# Altium schematic sheet VD Sensors.SchDoc
size A4
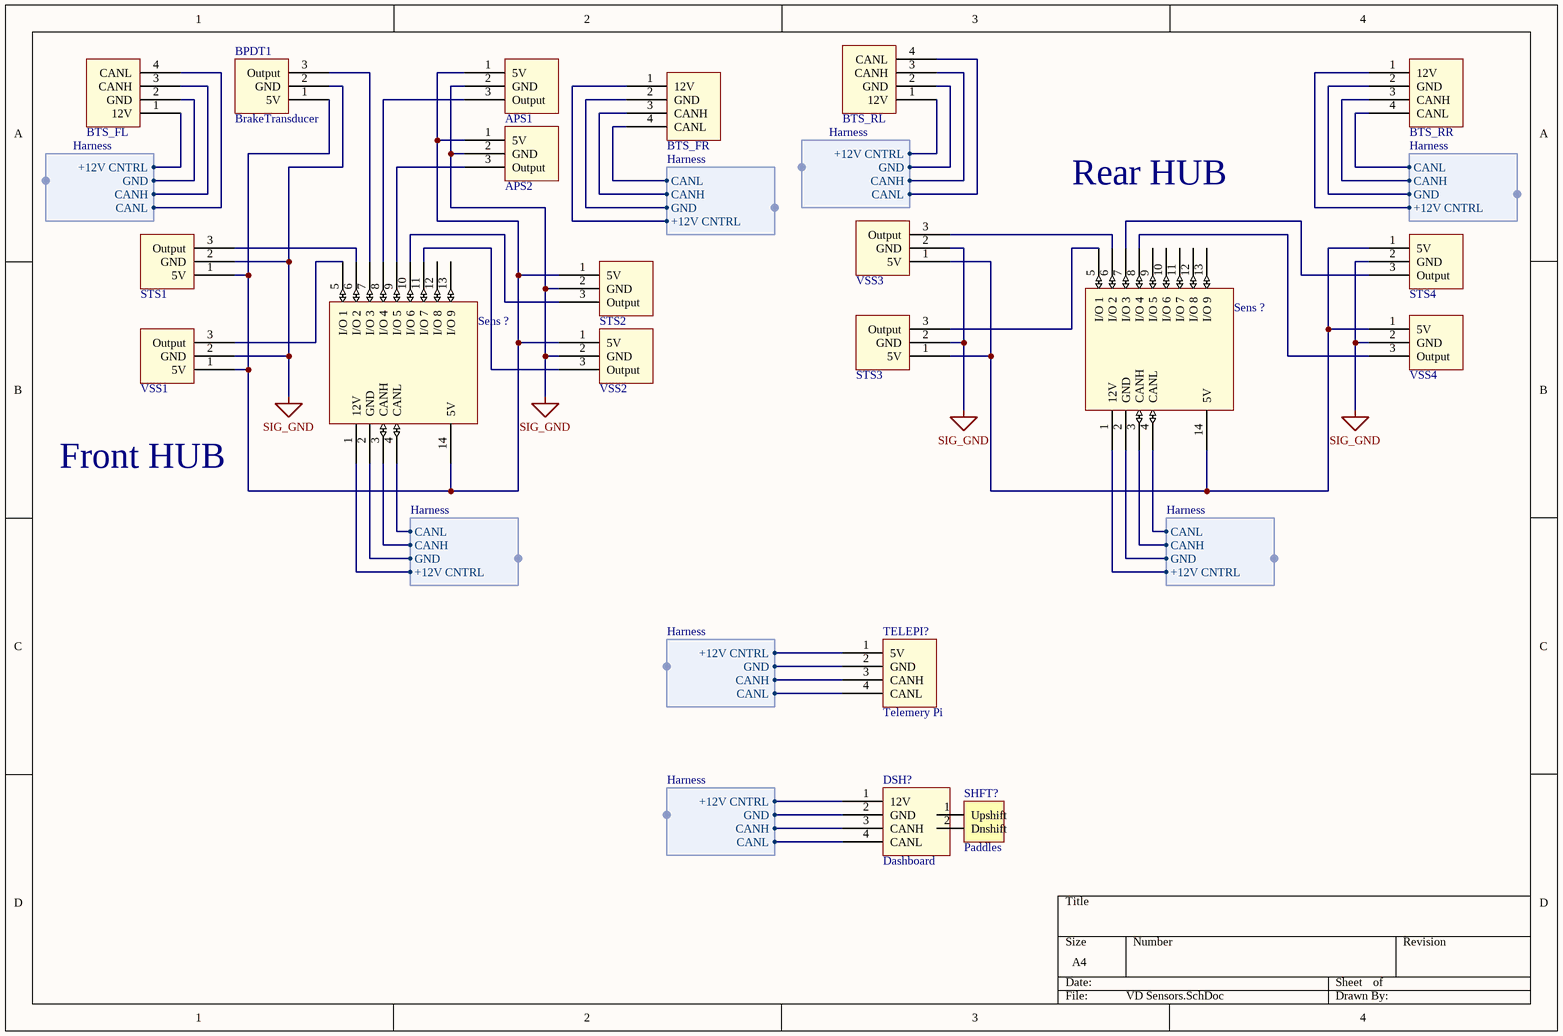
[diagram p0: VD Sensors.SchDoc]

## Parts
(Parts that share a designator on the sheet are numbered #1, #2 ... from top to bottom, then left to right.)
APS1  APS  (value not drawn)
APS2  APS  (value not drawn)
BPDT1  BrakeTransducer
BTS_FL  BTS  (value not drawn)
BTS_FR  BTS  (value not drawn)
BTS_RL  BTS  (value not drawn)
BTS_RR  BTS  (value not drawn)
DSH?  Dashboard
Sens_?#1  CanSensHub  (value not drawn)
Sens_?#2  CanSensHub  (value not drawn)
SHFT?  Paddles  [HDR1X2]
STS1  Susp  (value not drawn)
STS2  Susp  (value not drawn)
STS3  Susp  (value not drawn)
STS4  Susp  (value not drawn)
TELEPI?  Telemery Pi
VSS1  VSS  (value not drawn)
VSS2  VSS  (value not drawn)
VSS3  VSS  (value not drawn)
VSS4  VSS  (value not drawn)

## Harnesses
Harness: +12V CNTRL, GND, CANH, CANL

## Nets
SIG_GND: APS1.2(GND) APS2.2(GND) BPDT1.2(GND) STS1.2(GND) STS2.2(GND) STS3.2(GND) STS4.2(GND) VSS1.2(GND) VSS2.2(GND) VSS3.2(GND) VSS4.2(GND)
NetAPS1_1: APS1.1(5V) APS2.1(5V) BPDT1.1(5V) Sens_?#2.14(5V) STS1.1(5V) STS2.1(5V) VSS1.1(5V) VSS2.1(5V)
NetAPS1_3: APS1.3(Output) Sens_?#2.8(I/O_4)
NetAPS2_3: APS2.3(Output) Sens_?#2.9(I/O_5)
NetBPDT1_3: BPDT1.3(Output) Sens_?#2.7(I/O_3)
NetBTS_FL_1: BTS_FL.1(12V) ; harness Harness.+12V CNTRL
NetBTS_FL_2: BTS_FL.2(GND) ; harness Harness.GND
NetBTS_FL_3: BTS_FL.3(CANH) ; harness Harness.CANH
NetBTS_FL_4: BTS_FL.4(CANL) ; harness Harness.CANL
NetBTS_FR_1: BTS_FR.1(12V) ; harness Harness.+12V CNTRL
NetBTS_FR_2: BTS_FR.2(GND) ; harness Harness.GND
NetBTS_FR_3: BTS_FR.3(CANH) ; harness Harness.CANH
NetBTS_FR_4: BTS_FR.4(CANL) ; harness Harness.CANL
NetBTS_RL_1: BTS_RL.1(12V) ; harness Harness.+12V CNTRL
NetBTS_RL_2: BTS_RL.2(GND) ; harness Harness.GND
NetBTS_RL_3: BTS_RL.3(CANH) ; harness Harness.CANH
NetBTS_RL_4: BTS_RL.4(CANL) ; harness Harness.CANL
NetBTS_RR_1: BTS_RR.1(12V) ; harness Harness.+12V CNTRL
NetBTS_RR_2: BTS_RR.2(GND) ; harness Harness.GND
NetBTS_RR_3: BTS_RR.3(CANH) ; harness Harness.CANH
NetBTS_RR_4: BTS_RR.4(CANL) ; harness Harness.CANL
NetDSH?_1: DSH?.1(12V) ; harness Harness.+12V CNTRL
NetDSH?_2: DSH?.2(GND) ; harness Harness.GND
NetDSH?_3: DSH?.3(CANH) ; harness Harness.CANH
NetDSH?_4: DSH?.4(CANL) ; harness Harness.CANL
NetSens_?#1_1: Sens_?#1.1(12V) ; harness Harness.+12V CNTRL
NetSens_?#1_2: Sens_?#1.2(GND) ; harness Harness.GND
NetSens_?#1_3: Sens_?#1.3(CANH) ; harness Harness.CANH
NetSens_?#1_4: Sens_?#1.4(CANL) ; harness Harness.CANL
NetSens_?#1_5: Sens_?#1.5(I/O_1) STS3.3(Output)
NetSens_?#1_6: Sens_?#1.6(I/O_2) VSS3.3(Output)
NetSens_?#1_7: Sens_?#1.7(I/O_3) STS4.3(Output)
NetSens_?#1_8: Sens_?#1.8(I/O_4) VSS4.3(Output)
NetSens_?#1_14: Sens_?#1.14(5V) STS3.1(5V) STS4.1(5V) VSS3.1(5V) VSS4.1(5V)
NetSens_?#2_1: Sens_?#2.1(12V) ; harness Harness.+12V CNTRL
NetSens_?#2_2: Sens_?#2.2(GND) ; harness Harness.GND
NetSens_?#2_3: Sens_?#2.3(CANH) ; harness Harness.CANH
NetSens_?#2_4: Sens_?#2.4(CANL) ; harness Harness.CANL
NetSens_?#2_5: Sens_?#2.5(I/O_1) VSS1.3(Output)
NetSens_?#2_6: Sens_?#2.6(I/O_2) STS1.3(Output)
NetSens_?#2_10: Sens_?#2.10(I/O_6) STS2.3(Output)
NetSens_?#2_11: Sens_?#2.11(I/O_7) VSS2.3(Output)
NetTELEPI?_1: TELEPI?.1(5V) ; harness Harness.+12V CNTRL
NetTELEPI?_2: TELEPI?.2(GND) ; harness Harness.GND
NetTELEPI?_3: TELEPI?.3(CANH) ; harness Harness.CANH
NetTELEPI?_4: TELEPI?.4(CANL) ; harness Harness.CANL

Not connected (* = marked no-connect by the designer): Sens_?#1 9(I/O_5) 10(I/O_6) 11(I/O_7) 12(I/O_8) 13(I/O_9); Sens_?#2 12(I/O_8) 13(I/O_9); SHFT? 1(Upshift) 2(Dnshift)

## Notes on the sheet
- Rear HUB
- Front HUB

## Library data of the parts
APS1 APS2 = APS: Accelerator Pedal Sensor
BPDT1 = BrakeTransducer: Brake Pressure Transducer
BTS_FL BTS_FR BTS_RL BTS_RR = BTS: Brake Temperature Sensor
DSH? = Dash: Dashboard Connector
Sens_?#1 Sens_?#2 = Sensor Hub: Canduino Sensor Hub
SHFT? = Header 2: Header, 2-Pin; LatestRevisionDate: 17-Jul-2002; LatestRevisionNote: Re-released for DXP Platform.; Publisher: Altium Limited
STS1-STS4 = VSS: Suspension Travel Sensor
TELEPI? = TELEPI: Raspberry Pi used for telemetry
VSS1-VSS4 = VSS: Vehicle Speed Sensor